# EAGLE design HenrySchem (EAGLE 9.6.2)
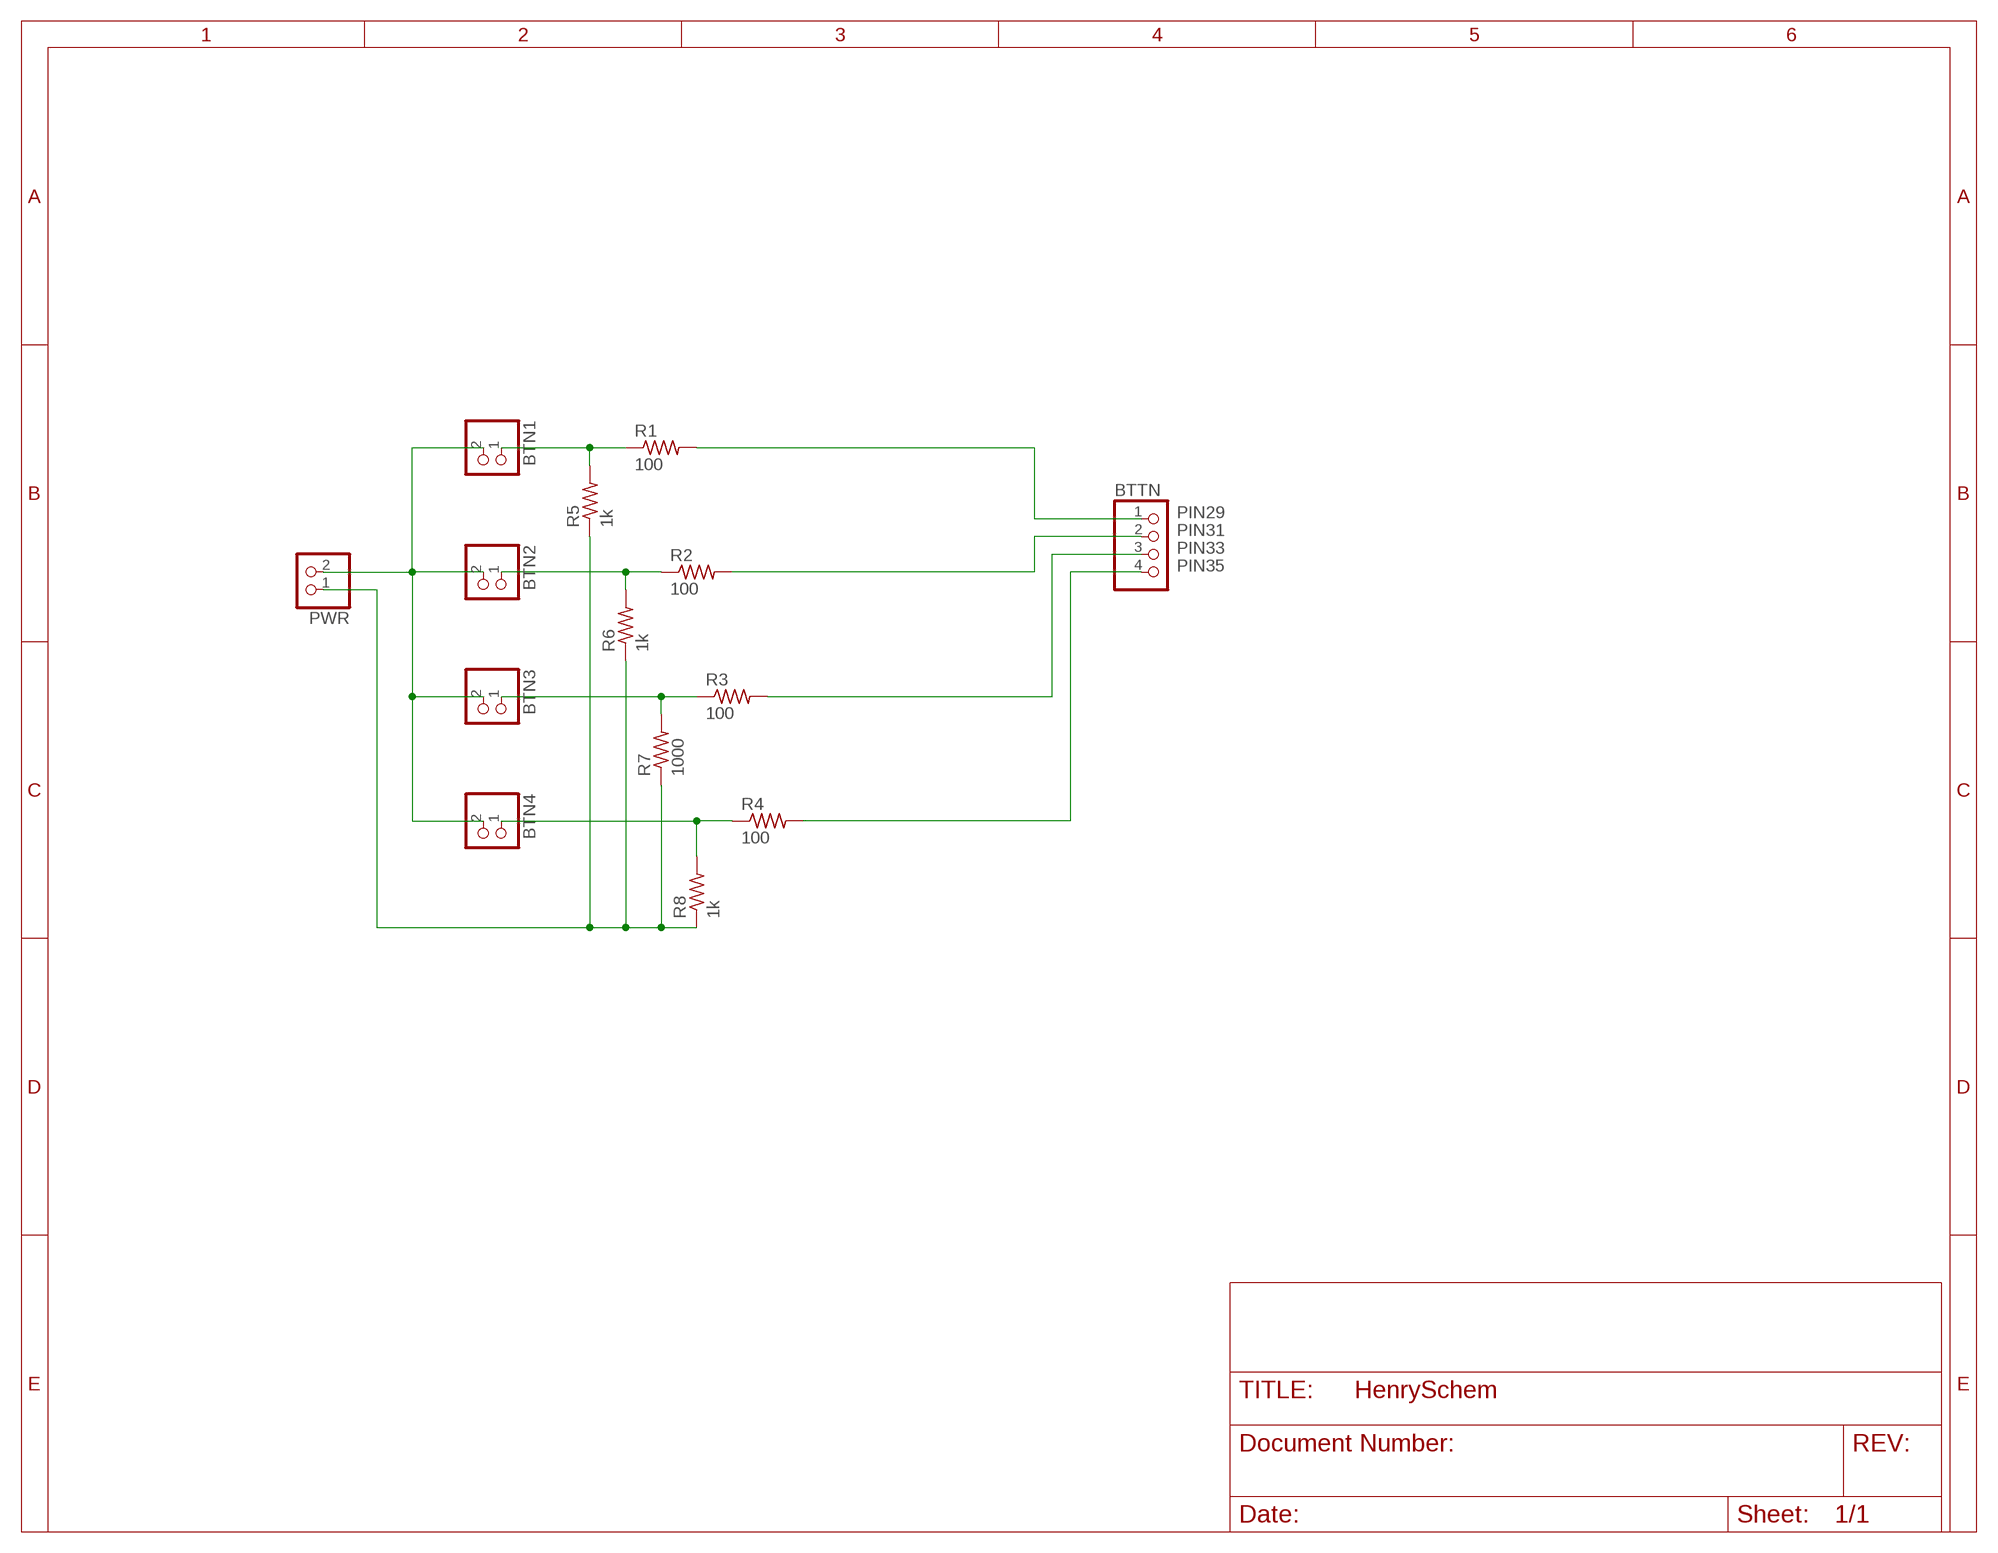
[diagram p0: schematic, sheet 1]

## Parts
BTN1  PINHD-1X2  [1X02]
BTN2  PINHD-1X2  [1X02]
BTN3  PINHD-1X2  [1X02]
BTN4  PINHD-1X2  [1X02]
BTTN  PINHD-1X4  [1X04]
PWR  PINHD-1X2  [1X02]
R1  100  R-US_0204/5  [0204/5]
R2  100  R-US_0204/5  [0204/5]
R3  100  R-US_0204/5  [0204/5]
R4  100  R-US_0204/5  [0204/5]
R5  1k  R-US_0204/5  [0204/5]
R6  1k  R-US_0204/5  [0204/5]
R7  1000  R-US_0204/5  [0204/5]
R8  1k  R-US_0204/5  [0204/5]

## Nets
N$1: BTN1.2 BTN2.2 BTN3.2 BTN4.2 PWR.2
N$6: PWR.1 R5.1 R6.1 R7.1 R8.1
N$7: BTN1.1 R1.1 R5.2
N$8: BTN2.1 R2.1 R6.2
N$9: BTN3.1 R3.1 R7.2
N$10: BTN4.1 R4.1 R8.2
PIN29: BTTN.1 R1.2
PIN31: BTTN.2 R2.2
PIN33: BTTN.3 R3.2
PIN35: BTTN.4 R4.2

## Library data of the parts
BTN1-BTN4 PWR = pinhead:PINHD-1X2: PIN HEADER
BTTN = pinhead:PINHD-1X4: PIN HEADER
R1-R8 = rcl:R-US_: RESISTOR, American symbol; SPICEPREFIX: R

## Board
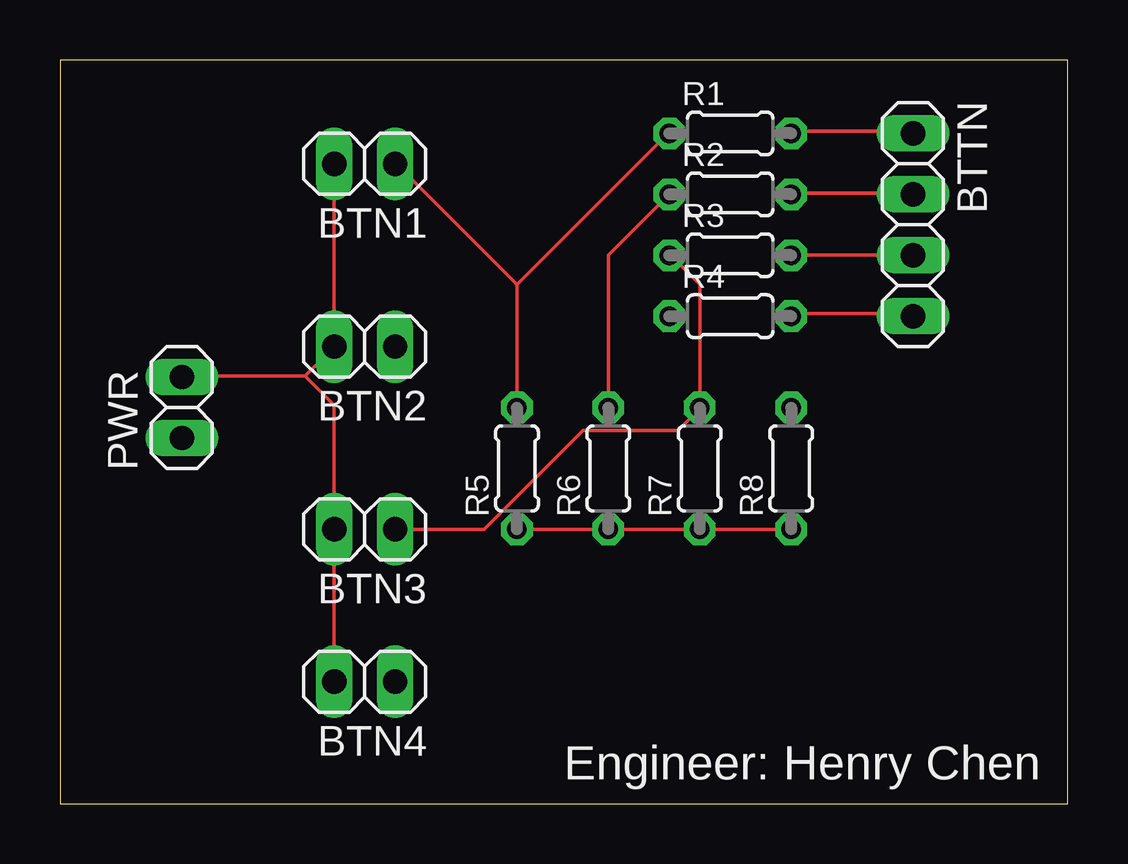
[diagram p1: board, top side]
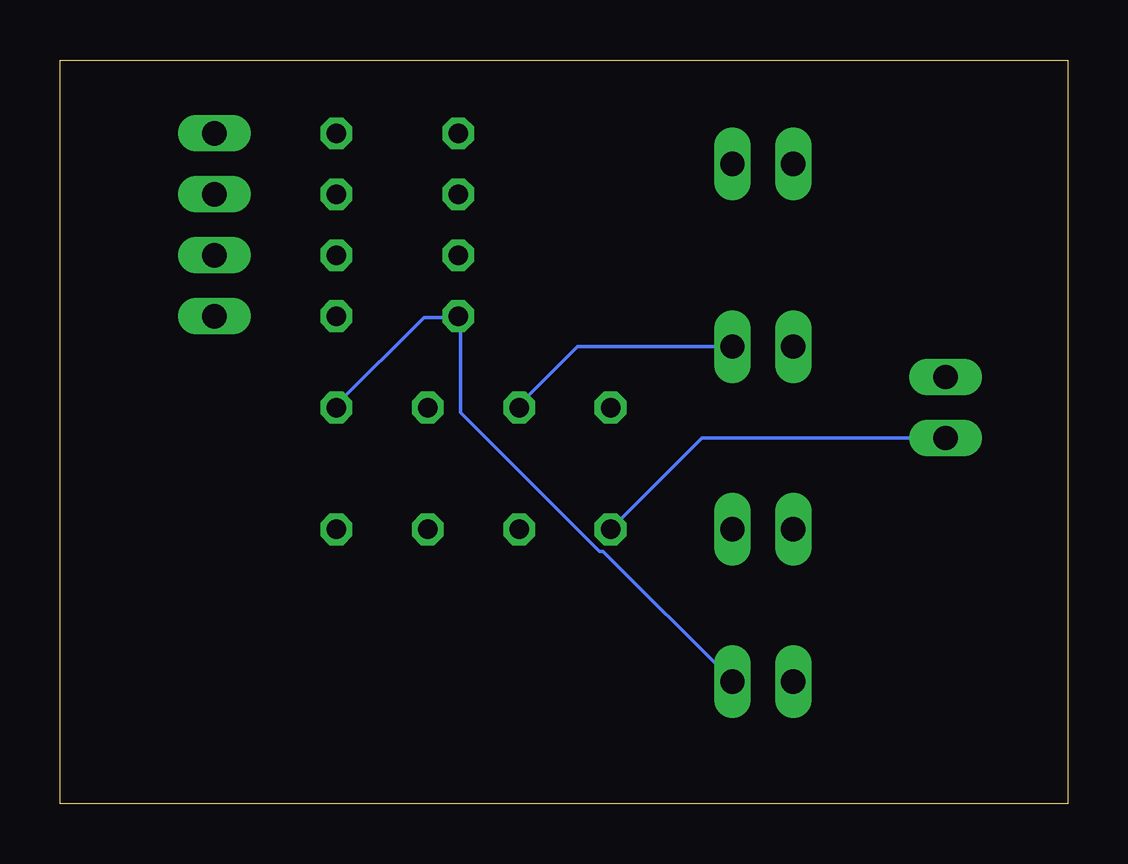
[diagram p2: board, bottom side, seen from below]

Size 42 x 31 mm. Coordinates in mm from the lower left corner, seen from the top.
Outline: 0,0 42,0 42,31 0,31 0,0
Copper layers (1*16): Top 0.035mm / dielectric 1.5mm / Bottom 0.035mm
Design rules "default": minimum track width 6mil, minimum drill 0.35mm, track to track 6mil, track to pad 6mil, pad to pad 6mil, via to via 6mil, smd to smd 6mil, copper to edge 40mil, drill to drill 6mil, minimum pad ring 10mil, minimum via ring 8mil, stop-mask expansion 4mil, vias tented up to drill 0mil, thermal gap 10mil

### Footprints (pad centres in the part's own frame; a part is rotated, then mirrored left to right if it is on the bottom)
1X02 = drill 1.016 long: 1 -1.27,0; 2 1.27,0
1X04 = drill 1.016 long: 1 -3.81,0; 2 -1.27,0; 3 1.27,0; 4 3.81,0
0204/5 = drill 0.813 octagon: 1 -2.54,0; 2 2.54,0

### Placement (x,y rotation side)
BTN1  12.7,26.67 180 top
BTN2  12.7,19.05 180 top
BTN3  12.7,11.43 180 top
BTN4  12.7,5.08 180 top
BTTN  35.56,24.13 270 top
PWR  5.08,16.51 90 top
R1  27.94,27.94 0 top
R2  27.94,25.4 0 top
R3  27.94,22.86 0 top
R4  27.94,20.32 0 top
R5  19.05,13.97 90 top
R6  22.86,13.97 90 top
R7  26.67,13.97 90 top
R8  30.48,13.97 90 top

### Tracks (layer width: path | path; a pad name or v marks a point on that pad's centre or on a via)
N$1
  Top 0.152: BTN4.2 BTN3.2 11.43,16.61 10.21,17.83 | 10.21,17.83 5.18,17.83 PWR.2 | 10.21,17.83 BTN2.2 BTN1.2
N$6
  Top 0.152: R5.1 R6.1 R7.1 R8.1
  Bottom 0.152: PWR.1 15.24,15.24 R5.1
N$7
  Top 0.152: 19.05,21.64 R5.2 | 19.05,21.64 14.02,26.67 BTN1.1 | 19.05,21.64 25.3,27.89 R1.1
N$8
  Top 0.152: R6.2 22.86,22.86 R2.1
  Bottom 0.152: BTN2.1 20.42,19.05 22.86,16.61 R6.2
N$9
  Top 0.152: R3.1 25.45,22.86 26.67,21.64 R7.2 26.67,16.46 25.76,15.54 21.79,15.54 17.68,11.43 BTN3.1
N$10
  Bottom 0.152: R8.2 30.48,16.61 26.82,20.27 25.45,20.27 R4.1 25.3,20.27 25.3,16.31 19.51,10.52 19.36,10.52 14.02,5.18 BTN4.1
PIN29
  Top 0.152: R1.2 30.48,28.04 35.51,28.04 BTTN.1
PIN31
  Top 0.152: R2.2 30.48,25.45 35.51,25.45 BTTN.2
PIN33
  Top 0.152: BTTN.3 R3.2
PIN35
  Top 0.152: R4.2 30.48,20.42 35.51,20.42 BTTN.4

### Text on the board
tPlace: Engineer: Henry Chen